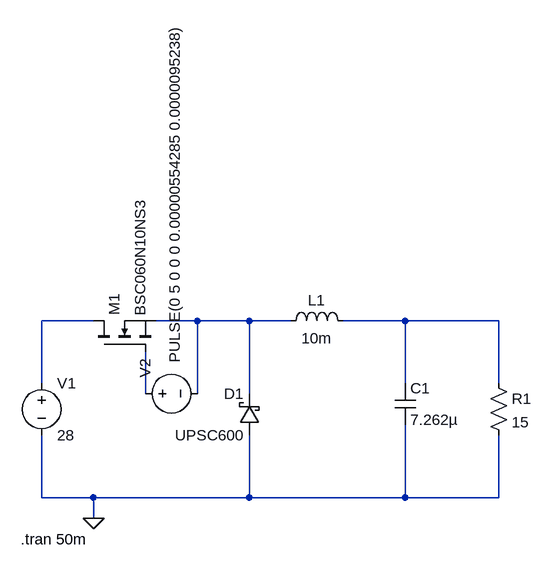
[diagram p0: schematic buck_circuit.asc]
buck_circuit.asc, the LTspice schematic file:
Version 4
SHEET 1 880 680
WIRE -128 16 -208 16
WIRE 32 16 -32 16
WIRE 112 16 32 16
WIRE 176 16 112 16
WIRE 352 16 256 16
WIRE 496 16 352 16
WIRE -208 112 -208 16
WIRE 352 112 352 16
WIRE 496 112 496 16
WIRE -48 128 -48 64
WIRE 32 128 32 16
WIRE 112 128 112 16
WIRE -208 288 -208 192
WIRE -128 288 -208 288
WIRE 112 288 112 192
WIRE 112 288 -128 288
WIRE 352 288 352 176
WIRE 352 288 112 288
WIRE 496 288 496 192
WIRE 496 288 352 288
WIRE -128 320 -128 288
FLAG -128 320 0
SYMBOL voltage -208 96 R0
WINDOW 123 0 0 Left 0
WINDOW 39 0 0 Left 0
SYMATTR InstName V1
SYMATTR Value 28
SYMBOL ind 160 32 R270
WINDOW 0 32 56 VTop 2
WINDOW 3 5 56 VBottom 2
SYMATTR InstName L1
SYMATTR Value 10m
SYMBOL cap 336 112 R0
SYMATTR InstName C1
SYMATTR Value 7.262µ
SYMBOL res 480 96 R0
SYMATTR InstName R1
SYMATTR Value 15
SYMBOL voltage -64 128 R270
WINDOW 123 0 0 Left 0
WINDOW 39 0 0 Left 0
WINDOW 3 47 61 Left 2
SYMATTR Value PULSE(0 5 0 0 0 0.00000554285 0.0000095238)
SYMATTR InstName V2
SYMBOL schottky 128 192 R180
WINDOW 0 24 64 Left 2
WINDOW 3 24 0 Left 2
SYMATTR InstName D1
SYMATTR Value UPSC600
SYMATTR Description Diode
SYMATTR Type diode
SYMBOL nmos -128 64 R270
SYMATTR InstName M1
SYMATTR Value BSC060N10NS3
TEXT -240 352 Left 2 !.tran 50m

The netlist it stands for:
* buck_circuit.asc
V1 N001 0 28
L1 N002 N003 10m
C1 N003 0 7.262µ
R1 N003 0 15
V2 N004 N002 PULSE(0 5 0 0 0 0.00000554285 0.0000095238)
D1 0 N002 UPSC600
M1 N001 N004 N002 N002 BSC060N10NS3
.model D D
.lib standard.dio
.model NMOS NMOS
.model PMOS PMOS
.lib standard.mos
.tran 50m
.backanno
.end